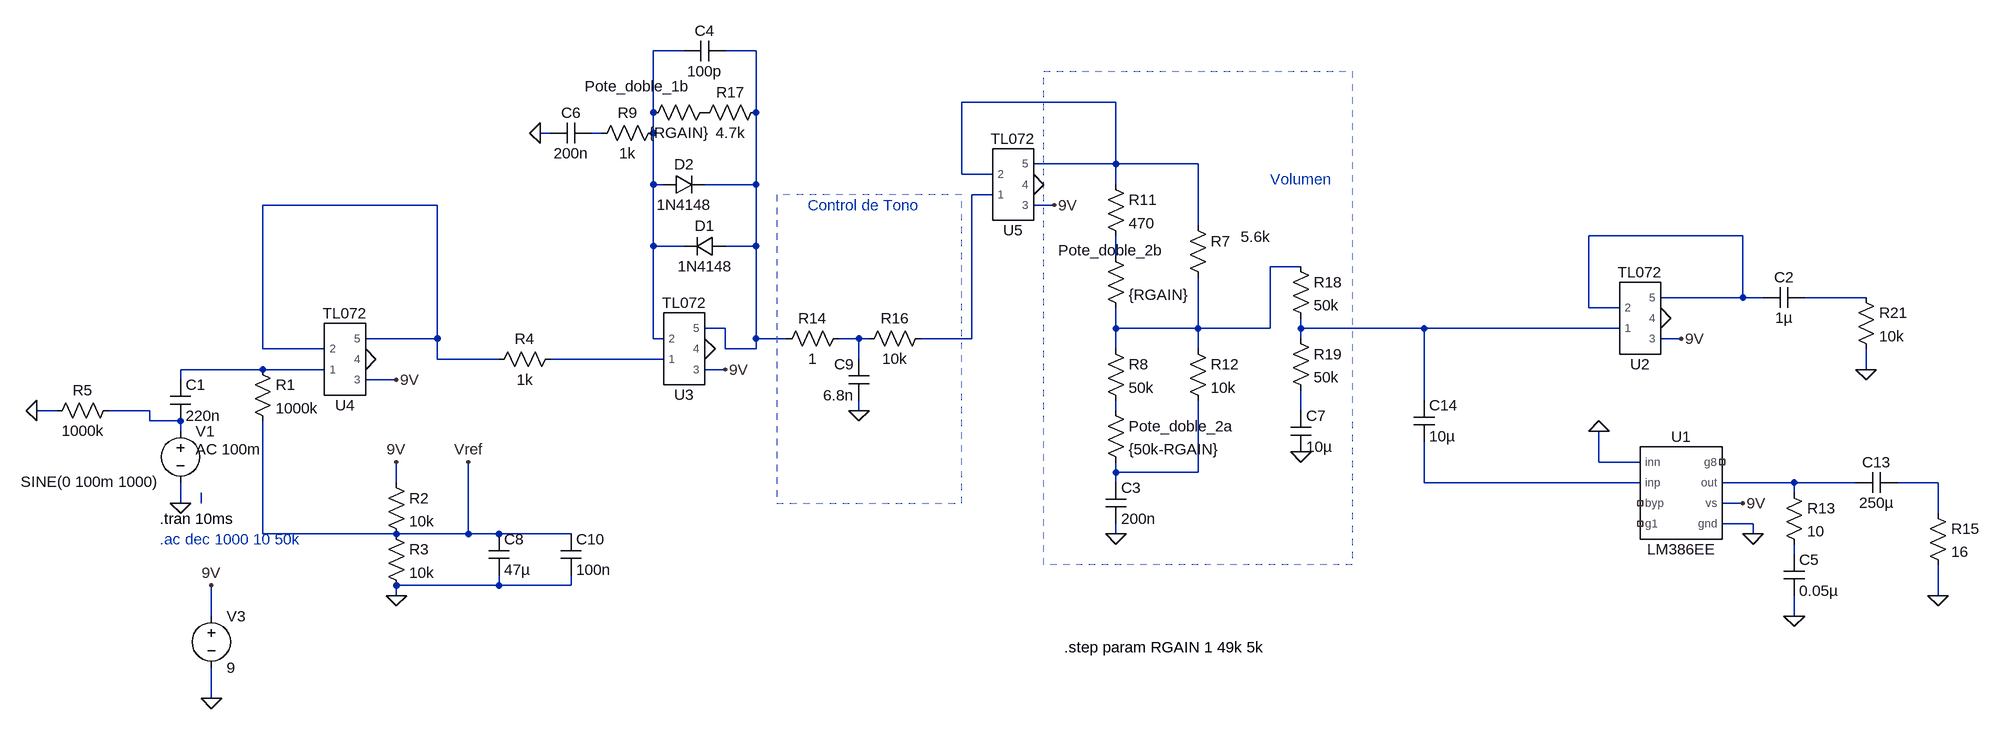
[diagram p0: schematic Overdrive_simple.asc]
Overdrive_simple.asc, the LTspice schematic file:
Version 4.1
SHEET 1 2740 788
WIRE 720 -464 672 -464
WIRE 832 -464 784 -464
WIRE 1392 -384 1152 -384
WIRE 672 -368 672 -464
WIRE 832 -368 832 -464
WIRE 512 -336 496 -336
WIRE 592 -336 576 -336
WIRE 672 -336 672 -368
WIRE 1392 -288 1392 -384
WIRE 1392 -288 1264 -288
WIRE 1520 -288 1392 -288
WIRE 1152 -272 1152 -384
WIRE 1200 -272 1152 -272
WIRE 672 -256 672 -336
WIRE 688 -256 672 -256
WIRE 832 -256 832 -368
WIRE 832 -256 752 -256
WIRE 1392 -256 1392 -288
WIRE 1200 -240 1168 -240
WIRE 336 -224 64 -224
WIRE 1296 -224 1264 -224
WIRE 1520 -192 1520 -288
WIRE 2368 -176 2128 -176
WIRE 672 -160 672 -256
WIRE 720 -160 672 -160
WIRE 832 -160 832 -256
WIRE 832 -160 784 -160
WIRE 1392 -144 1392 -176
WIRE 1680 -128 1632 -128
WIRE 2368 -80 2368 -176
WIRE 2368 -80 2240 -80
WIRE 2400 -80 2368 -80
WIRE 2560 -80 2464 -80
WIRE 2128 -64 2128 -176
WIRE 2176 -64 2128 -64
WIRE 784 -32 752 -32
WIRE 1392 -32 1392 -64
WIRE 1520 -32 1520 -112
WIRE 1520 -32 1392 -32
WIRE 1632 -32 1632 -128
WIRE 1632 -32 1520 -32
WIRE 1680 -32 1680 -48
WIRE 1872 -32 1680 -32
WIRE 2176 -32 1872 -32
WIRE 336 -16 336 -224
WIRE 336 -16 224 -16
WIRE 672 -16 672 -160
WIRE 688 -16 672 -16
WIRE 832 -16 832 -160
WIRE 880 -16 832 -16
WIRE 992 -16 960 -16
WIRE 1008 -16 992 -16
WIRE 1168 -16 1168 -240
WIRE 1168 -16 1088 -16
WIRE 1680 -16 1680 -32
WIRE 2272 -16 2240 -16
WIRE 64 0 64 -224
WIRE 160 0 64 0
WIRE 784 0 784 -32
WIRE 832 0 832 -16
WIRE 832 0 784 0
WIRE 1392 0 1392 -32
WIRE 1520 0 1520 -32
WIRE 336 16 336 -16
WIRE 432 16 336 16
WIRE 688 16 512 16
WIRE 992 16 992 -16
WIRE 64 32 -64 32
WIRE 160 32 64 32
WIRE 784 32 752 32
WIRE 2560 32 2560 0
WIRE -64 48 -64 32
WIRE 272 48 224 48
WIRE 1872 80 1872 -32
WIRE -256 96 -288 96
WIRE -112 96 -176 96
WIRE 992 96 992 80
WIRE 1392 96 1392 80
WIRE 1680 96 1680 64
WIRE -112 112 -112 96
WIRE -64 112 -112 112
WIRE -64 128 -64 112
WIRE 2144 176 2144 128
WIRE 2208 176 2144 176
WIRE 1392 192 1392 176
WIRE 1520 192 1520 80
WIRE 1520 192 1392 192
WIRE 272 208 272 176
WIRE 1392 208 1392 192
WIRE 1872 208 1872 144
WIRE 2208 208 1872 208
WIRE 2448 208 2336 208
WIRE 2544 208 2448 208
WIRE 2672 208 2608 208
WIRE 2448 224 2448 208
WIRE -64 240 -64 208
WIRE -32 240 -32 224
WIRE 2368 240 2336 240
WIRE 2672 256 2672 208
WIRE 2384 272 2336 272
WIRE 64 288 64 112
WIRE 272 288 64 288
WIRE 384 288 384 176
WIRE 384 288 272 288
WIRE 432 288 384 288
WIRE 544 288 432 288
WIRE 1392 288 1392 272
WIRE 2384 288 2384 272
WIRE 2448 320 2448 304
WIRE 432 368 432 352
WIRE 432 368 272 368
WIRE 544 368 544 352
WIRE 544 368 432 368
WIRE 272 384 272 368
WIRE 2672 384 2672 336
WIRE -16 416 -16 368
WIRE 2448 416 2448 384
WIRE -16 544 -16 496
FLAG -64 240 0
FLAG 496 -336 0
FLAG 224 16 0
FLAG 752 0 0
FLAG -16 544 0
FLAG -16 368 9V
FLAG 784 32 9V
FLAG 272 48 9V
FLAG 272 384 0
FLAG 272 176 9V
FLAG 2240 -48 0
FLAG 2272 -16 9V
FLAG 1392 288 0
FLAG 384 176 Vref
FLAG 2560 32 0
FLAG 992 96 0
FLAG -288 96 0
FLAG 2384 288 0
FLAG 2368 240 9V
FLAG 2144 128 0
FLAG 2448 416 0
FLAG 2672 384 0
FLAG 1264 -256 0
FLAG 1296 -224 9V
FLAG 1680 160 0
SYMBOL voltage -64 112 R0
WINDOW 123 24 44 Left 2
WINDOW 39 0 0 Left 0
WINDOW 3 -249 95 Left 2
SYMATTR Value2 AC 100m
SYMATTR Value SINE(0 100m 1000)
SYMATTR InstName V1
SYMBOL cap -80 48 R0
SYMATTR InstName C1
SYMATTR Value 220n
SYMBOL res 48 16 R0
SYMATTR InstName R1
SYMATTR Value 1000k
SYMBOL res 256 192 R0
SYMATTR InstName R2
SYMATTR Value 10k
SYMBOL res 256 272 R0
SYMATTR InstName R3
SYMATTR Value 10k
SYMBOL res 528 0 R90
WINDOW 0 0 56 VBottom 2
WINDOW 3 32 56 VTop 2
SYMATTR InstName R4
SYMATTR Value 1k
SYMBOL diode 688 -272 M90
WINDOW 0 0 32 VBottom 2
WINDOW 3 32 32 VTop 2
SYMATTR InstName D2
SYMATTR Value 1N4148
SYMBOL res 768 -384 R90
WINDOW 0 -9 121 VBottom 2
WINDOW 3 32 56 VTop 2
SYMATTR InstName Pote_doble_1b
SYMATTR Value {RGAIN}
SYMBOL res 688 -352 R90
WINDOW 0 0 56 VBottom 2
WINDOW 3 32 56 VTop 2
SYMATTR InstName R9
SYMATTR Value 1k
SYMBOL diode 784 -176 R90
WINDOW 0 0 32 VBottom 2
WINDOW 3 32 32 VTop 2
SYMATTR InstName D1
SYMATTR Value 1N4148
SYMBOL cap 576 -352 R90
WINDOW 0 0 32 VBottom 2
WINDOW 3 32 32 VTop 2
SYMATTR InstName C6
SYMATTR Value 200n
SYMBOL res 1376 -160 R0
WINDOW 0 -74 6 Left 2
SYMATTR InstName Pote_doble_2b
SYMATTR Value {RGAIN}
SYMBOL voltage -16 400 R0
WINDOW 123 0 0 Left 0
WINDOW 39 0 0 Left 0
SYMATTR InstName V3
SYMATTR Value 9
SYMBOL res 1376 80 R0
SYMATTR InstName Pote_doble_2a
SYMATTR Value {50k-RGAIN}
SYMBOL cap 2464 -96 R90
WINDOW 0 0 32 VBottom 2
WINDOW 3 32 32 VTop 2
SYMATTR InstName C2
SYMATTR Value 1µ
SYMBOL cap 1376 208 R0
SYMATTR InstName C3
SYMATTR Value 200n
SYMBOL cap 416 288 R0
SYMATTR InstName C8
SYMATTR Value 47µ
SYMBOL cap 784 -480 R90
WINDOW 0 0 32 VBottom 2
WINDOW 3 32 32 VTop 2
SYMATTR InstName C4
SYMATTR Value 100p
SYMBOL TL072 2208 -48 M180
SYMATTR InstName U2
SYMBOL TL072 720 0 M180
SYMATTR InstName U3
SYMBOL TL072 192 16 M180
SYMATTR InstName U4
SYMBOL res 2544 -96 R0
SYMATTR InstName R21
SYMATTR Value 10k
SYMBOL cap 1008 80 R180
WINDOW 0 24 56 Left 2
WINDOW 3 24 8 Left 2
SYMATTR InstName C9
SYMATTR Value 6.8n
SYMBOL res -160 80 R90
WINDOW 0 0 56 VBottom 2
WINDOW 3 32 56 VTop 2
SYMATTR InstName R5
SYMATTR Value 1000k
SYMBOL cap 528 288 R0
SYMATTR InstName C10
SYMATTR Value 100n
SYMBOL res 1504 -208 R0
WINDOW 3 82 33 Left 2
SYMATTR Value 5.6k
SYMATTR InstName R7
SYMBOL res 1504 -16 R0
SYMATTR InstName R12
SYMATTR Value 10k
SYMBOL res 848 -384 R90
WINDOW 0 0 56 VBottom 2
WINDOW 3 32 56 VTop 2
SYMATTR InstName R17
SYMATTR Value 4.7k
SYMBOL res 1376 -16 R0
SYMATTR InstName R8
SYMATTR Value 50k
SYMBOL LM386EE 2272 224 R0
SYMATTR InstName U1
SYMBOL cap 2432 320 R0
SYMATTR InstName C5
SYMATTR Value 0.05µ
SYMBOL res 2432 208 R0
SYMATTR InstName R13
SYMATTR Value 10
SYMBOL cap 2608 192 R90
WINDOW 0 0 32 VBottom 2
WINDOW 3 32 32 VTop 2
SYMATTR InstName C13
SYMATTR Value 250µ
SYMBOL res 2656 240 R0
SYMATTR InstName R15
SYMATTR Value 16
SYMBOL cap 1856 80 R0
SYMATTR InstName C14
SYMATTR Value 10µ
SYMBOL TL072 1232 -256 M180
SYMATTR InstName U5
SYMBOL res 1376 -272 R0
SYMATTR InstName R11
SYMATTR Value 470
SYMBOL res 976 -32 R90
WINDOW 0 0 56 VBottom 2
WINDOW 3 32 56 VTop 2
SYMATTR InstName R14
SYMATTR Value 1
SYMBOL res 1104 -32 R90
WINDOW 0 0 56 VBottom 2
WINDOW 3 32 56 VTop 2
SYMATTR InstName R16
SYMATTR Value 10k
SYMBOL res 1664 -144 R0
SYMATTR InstName R18
SYMATTR Value 50k
SYMBOL res 1664 -32 R0
SYMATTR InstName R19
SYMATTR Value 50k
SYMBOL cap 1664 96 R0
SYMATTR InstName C7
SYMATTR Value 10µ
TEXT -96 264 Left 2 !.tran 10ms
TEXT 1632 -264 Left 2 ;Volumen
TEXT 912 -224 Left 2 ;Control de Tono
TEXT -96 296 Left 2 ;.ac dec 1000 10 50k
TEXT 1312 464 Left 2 !.step param RGAIN 1 49k 5k
RECTANGLE Normal 864 240 1152 -240 2
RECTANGLE Normal 1760 336 1280 -432 2

The netlist it stands for:
* Overdrive_simple.asc
V1 N015 0 SINE(0 100m 1000) AC 100m
C1 N014 N015 220n
R1 N014 Vref 1000k
R2 9V Vref 10k
R3 Vref 0 10k
R4 N013 N006 1k
D2 N001 N002 1N4148
R§Pote_doble_1b P001 N001 {RGAIN}
R9 N001 N004 1k
D1 N002 N001 1N4148
C6 N004 0 200n
R§Pote_doble_2b N008 N009 {RGAIN}
V3 9V 0 9
R§Pote_doble_2a N016 N018 {50k-RGAIN}
C2 N010 N007 1µ
C3 N018 0 200n
C8 Vref 0 47µ
C4 N002 N001 100p
X§U2 N011 N007 9V 0 N007 TL072  ; pins 1 2 3 4 5
X§U3 N013 N001 9V 0 N002 TL072  ; pins 1 2 3 4 5
X§U4 N014 N006 9V 0 N006 TL072  ; pins 1 2 3 4 5
R21 N010 0 10k
C9 0 N012 6.8n
R5 N015 0 1000k
C10 Vref 0 100n
R7 N003 N009 5.6k
R12 N009 N018 10k
R17 N002 P001 4.7k
R8 N009 N016 50k
X§U1 0 N019 NC_01 NC_02 NC_03 N020 9V 0 LM386EE  ; pins inn inp byp g1 g8 out vs gnd
C5 N023 0 0.05µ
R13 N020 N023 10
C13 N021 N020 250µ
R15 N021 0 16
C14 N011 N019 10µ
X§U5 N005 N003 9V 0 N003 TL072  ; pins 1 2 3 4 5
R11 N003 N008 470
R14 N012 N002 1
R16 N005 N012 10k
R18 N009 N011 50k
R19 N011 N017 50k
C7 N017 0 10µ
.model D D
.lib standard.dio
.tran 10ms
* Volumen
* Control de Tono
* .ac dec 1000 10 50k
.step param RGAIN 1 49k 5k
.lib C:\Users\Usuario\Documents\Proyecto_Pedal\Overdrive-guitar-pedal-project\Simulaciones\TL072.lib
.lib C:\Users\Usuario\Documents\Proyecto_Pedal\Overdrive-guitar-pedal-project\Simulaciones\LM386EE.sub
.backanno
.end